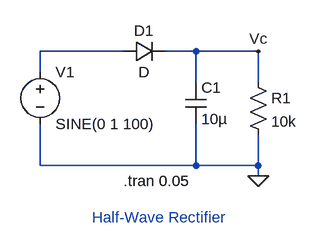
[diagram p0: schematic Half_Wave_Rectifier.asc]
Half_Wave_Rectifier.asc, the LTspice schematic file:
Version 4
SHEET 1 880 680
WIRE 352 240 224 240
WIRE 464 240 416 240
WIRE 560 240 464 240
WIRE 224 272 224 240
WIRE 464 288 464 240
WIRE 560 288 560 240
WIRE 224 416 224 352
WIRE 464 416 464 352
WIRE 464 416 224 416
WIRE 560 416 560 368
WIRE 560 416 464 416
WIRE 560 432 560 416
FLAG 560 432 0
FLAG 560 240 Vc
SYMBOL Res 544 272 R0
SYMATTR InstName R1
SYMATTR Value 10k
SYMBOL Voltage 224 256 R0
SYMATTR InstName V1
SYMATTR Value SINE(0 1 100)
SYMBOL Diode 352 256 R270
WINDOW 0 32 32 VTop 2
WINDOW 3 0 32 VBottom 2
SYMATTR InstName D1
SYMBOL Cap 448 288 R0
SYMATTR InstName C1
SYMATTR Value 10µ
TEXT 352 440 Left 2 !.tran 0.05
TEXT 304 496 Left 2 ;Half-Wave Rectifier

The netlist it stands for:
* Half_Wave_Rectifier.asc
R1 Vc 0 10k
V1 N001 0 SINE(0 1 100)
D1 N001 Vc D
C1 Vc 0 10µ
.model D D
.lib standard.dio
.tran 0.05
* Half-Wave Rectifier
.backanno
.end